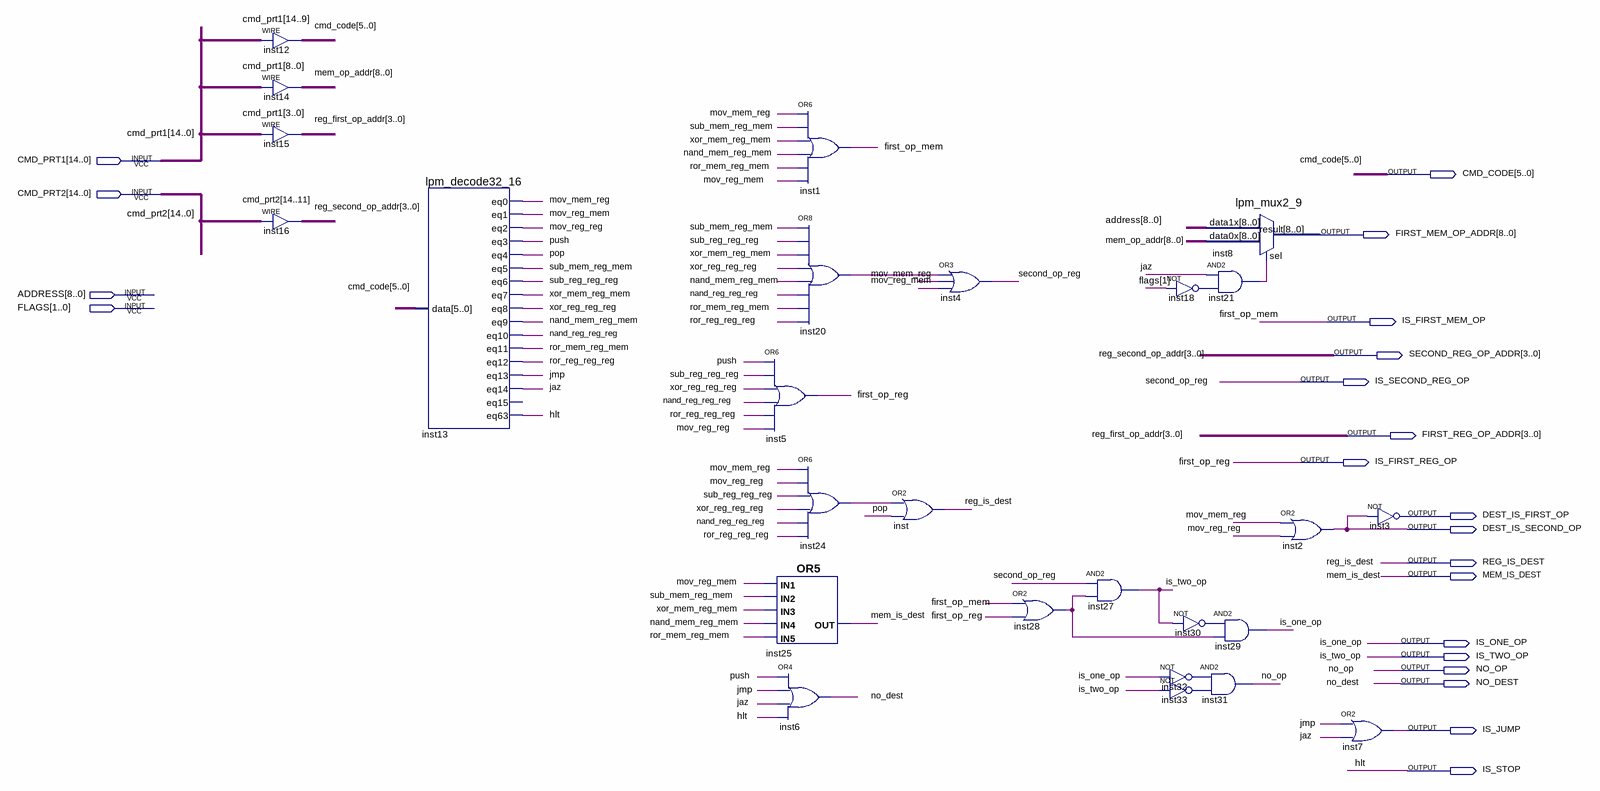
[diagram p0: schematic sheet]
// Quartus schematic COMMAND_PARSER.bdf as structural Verilog: 26 symbols, 21 pins
module COMMAND_PARSER (
  input  [14:0] CMD_PRT1,
  input  [14:0] CMD_PRT2,
  input  [8:0] ADDRESS,
  input  [1:0] FLAGS,
  output [5:0] CMD_CODE,
  output [8:0] FIRST_MEM_OP_ADDR,
  output IS_FIRST_MEM_OP,
  output [3:0] SECOND_REG_OP_ADDR,
  output IS_SECOND_REG_OP,
  output [3:0] FIRST_REG_OP_ADDR,
  output IS_FIRST_REG_OP,
  output DEST_IS_FIRST_OP,
  output DEST_IS_SECOND_OP,
  output REG_IS_DEST,
  output MEM_IS_DEST,
  output IS_ONE_OP,
  output IS_TWO_OP,
  output NO_OP,
  output NO_DEST,
  output IS_JUMP,
  output IS_STOP
);

  wire inst18_out, inst20_out, inst21_out, inst24_out, inst28_out, inst30_out, inst32_out, inst33_out, jaz,
       jmp, mov_mem_reg, mov_reg_mem, mov_reg_reg, nand_mem_reg_mem, nand_reg_reg_reg, pop, push,
       ror_mem_reg_mem, ror_reg_reg_reg, sub_mem_reg_mem, sub_reg_reg_reg, xor_mem_reg_mem, xor_reg_reg_reg;
  wire [8:0] mem_op_addr;

  assign CMD_CODE = CMD_PRT1[14:9];  // WIRE inst12
  assign mem_op_addr = CMD_PRT1[8:0];  // WIRE inst14
  assign FIRST_REG_OP_ADDR = CMD_PRT1[3:0];  // WIRE inst15
  assign SECOND_REG_OP_ADDR = CMD_PRT2[14:11];  // WIRE inst16
  lpm_decode32_16 inst13 (
    .data(CMD_CODE), .eq0(mov_mem_reg), .eq1(mov_reg_mem), .eq2(mov_reg_reg), .eq3(push), .eq4(pop),
    .eq5(sub_mem_reg_mem), .eq6(sub_reg_reg_reg), .eq7(xor_mem_reg_mem), .eq8(xor_reg_reg_reg),
    .eq9(nand_mem_reg_mem), .eq10(nand_reg_reg_reg), .eq11(ror_mem_reg_mem), .eq12(ror_reg_reg_reg),
    .eq13(jmp), .eq14(jaz), .eq63(IS_STOP));  // open: eq15
  or inst1 (IS_FIRST_MEM_OP, mov_mem_reg, sub_mem_reg_mem, xor_mem_reg_mem, nand_mem_reg_mem, ror_mem_reg_mem, mov_reg_mem);
  or inst20 (inst20_out, sub_mem_reg_mem, sub_reg_reg_reg, xor_mem_reg_mem, xor_reg_reg_reg, nand_mem_reg_mem, nand_reg_reg_reg, ror_mem_reg_mem, ror_reg_reg_reg);
  or inst5 (IS_FIRST_REG_OP, push, sub_reg_reg_reg, xor_reg_reg_reg, nand_reg_reg_reg, ror_reg_reg_reg, mov_reg_reg);
  or inst24 (inst24_out, mov_mem_reg, mov_reg_reg, sub_reg_reg_reg, xor_reg_reg_reg, nand_reg_reg_reg, ror_reg_reg_reg);
  or inst25 (MEM_IS_DEST, mov_reg_mem, sub_mem_reg_mem, xor_mem_reg_mem, nand_mem_reg_mem, ror_mem_reg_mem);
  or inst6 (NO_DEST, push, jmp, jaz, IS_STOP);
  or inst (REG_IS_DEST, inst24_out, pop);
  or inst4 (IS_SECOND_REG_OP, inst20_out, mov_mem_reg, mov_reg_mem);
  or inst28 (inst28_out, IS_FIRST_MEM_OP, IS_FIRST_REG_OP);
  and inst27 (IS_TWO_OP, IS_SECOND_REG_OP, inst28_out);
  not inst18 (inst18_out, FLAGS[1]);
  not inst30 (inst30_out, IS_TWO_OP);
  not inst32 (inst32_out, IS_ONE_OP);
  not inst33 (inst33_out, IS_TWO_OP);
  lpm_mux2_9 inst8 (.data1x(ADDRESS), .data0x(mem_op_addr), .sel(inst21_out), .result(FIRST_MEM_OP_ADDR));
  and inst21 (inst21_out, jaz, inst18_out);
  and inst29 (IS_ONE_OP, inst30_out, inst28_out);
  and inst31 (NO_OP, inst32_out, inst33_out);
  or inst2 (DEST_IS_SECOND_OP, mov_mem_reg, mov_reg_reg);
  or inst7 (IS_JUMP, jmp, jaz);
  not inst3 (DEST_IS_FIRST_OP, DEST_IS_SECOND_OP);

  // Other names for the same wires on the sheet: first_op_mem = IS_FIRST_MEM_OP; first_op_reg = IS_FIRST_REG_OP;
  //   hlt = IS_STOP; reg_first_op_addr[3:0] = FIRST_REG_OP_ADDR; reg_second_op_addr[3:0] = SECOND_REG_OP_ADDR;
  //   second_op_reg = IS_SECOND_REG_OP
endmodule
